# Altium schematic sheet Power_Amplifier.SchDoc
size A4; SheetNumber: 1; SheetTotal: 1; SPICEModelCachePYBBRKTT: <root> / <DocumentId>PYBBRKTT</DocumentId> / <CacheFrame Number="0"> / <Model Name="cap" Kind="MDL"> / <Text>*Default semiconductor capacitor / .MODEL CAP C()</Text> / </Model> / <Model Name="nmos" Kind="MDL"> / <Text>*Default N-Channel MOSFET / *Pinout: D,G,S / .MODEL NMOS NMOS()</Text> / </Model> / </CacheFrame> / </root>
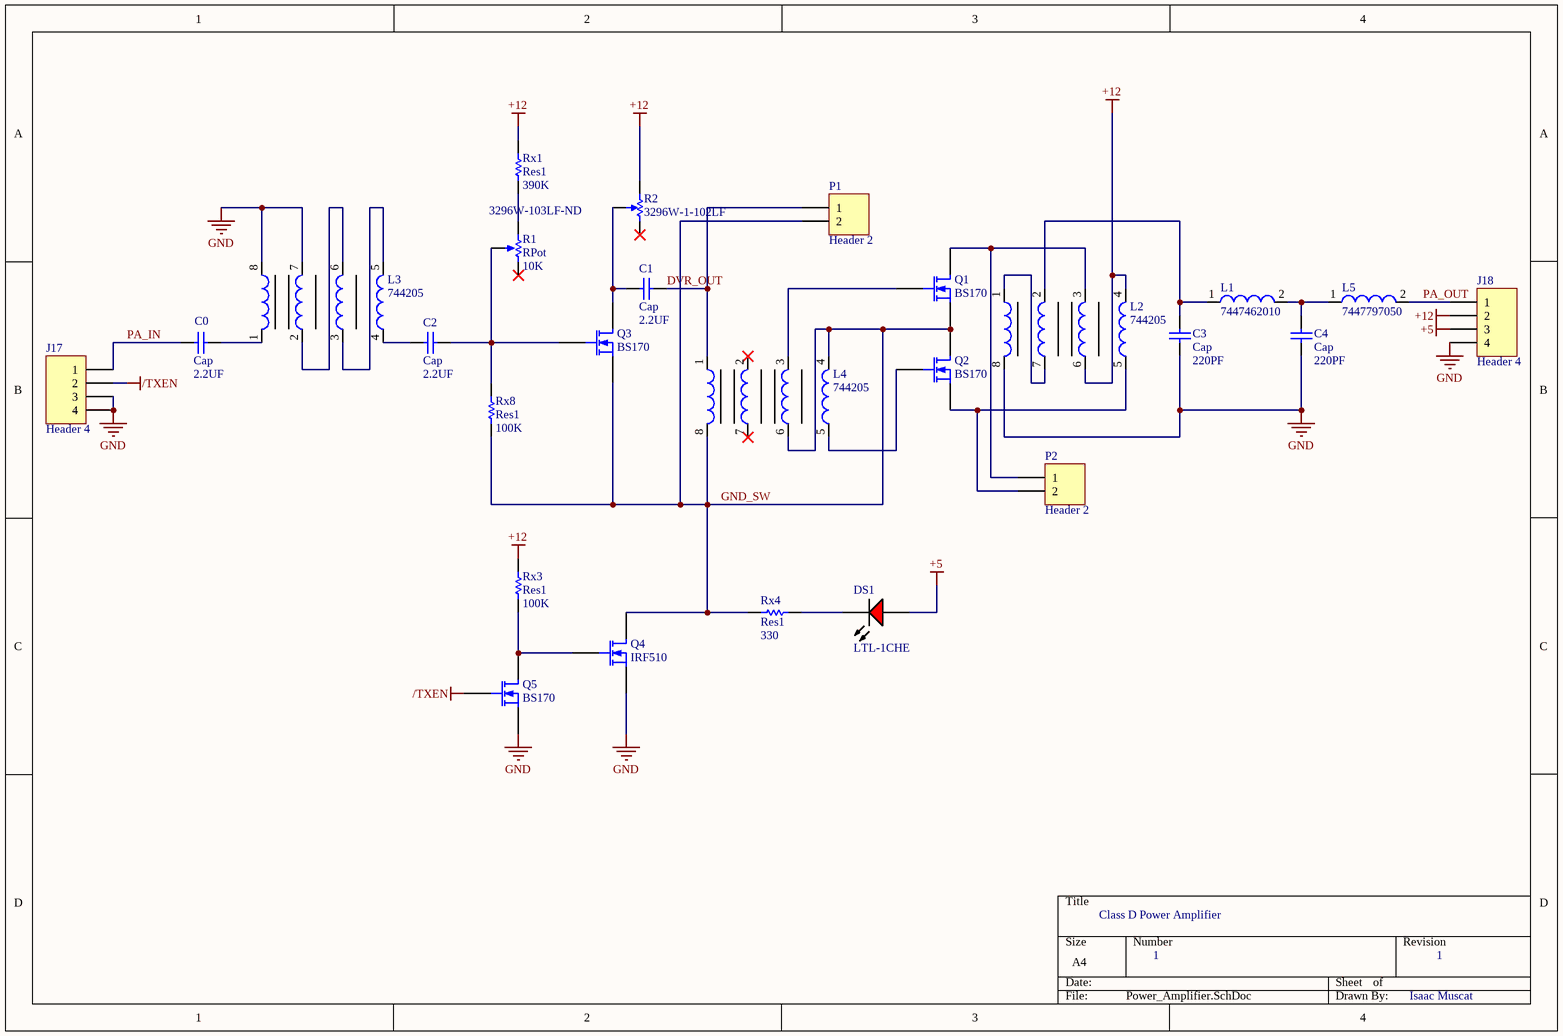
[diagram p0: Power_Amplifier.SchDoc]

## Parts
C0  Cap  value 2.2UF  [RADIAL-0.1]
C1  Cap  value 2.2UF  [RADIAL-0.1]
C2  Cap  value 2.2UF  [RADIAL-0.1]
C3  Cap  value 220PF  [RADIAL-0.1]
C4  Cap  value 220PF  [RADIAL-0.1]
DS1  LTL-1CHE  [INDPR60-254-520X380X650]
J17  Header 4  [HDR1X4]
J18  Header 4  [HDR1X4]
L1  7447462010  [WE-TI-XS]
L2  744205  [WE-SL]
L3  744205  [WE-SL]
L4  744205  [WE-SL]
L5  7447797050  [WE-PDF-1045]
P1  Header 2  [HDR1X2]
P2  Header 2  [HDR1X2]
Q1  BS170  [TO-92]
Q2  BS170  [TO-92]
Q3  BS170  [TO-92]
Q4  IRF510  [TO-220AB]
Q5  BS170  [TO-92]
R1  RPot  value 10K  Supplier Part Number 1: 3296W-103LF-ND  [VR5]
R2  3296W-1-102LF  [BOUR-3296W-1-3]
Rx1  Res1  value 390K  [AXIAL-0.1-RES]
Rx3  Res1  value 100K  [AXIAL-0.1-RES]
Rx4  Res1  value 330  [AXIAL-0.1-RES]
Rx8  Res1  value 100K  [AXIAL-0.1-RES]

## Nets
+5: DS1.1(A) J18.3
+12: J18.2 L2.4 L2.6 R2.1(A) Rx1.2 Rx3.1
/TXEN: J17.2 Q5.2(G)
GND: C3.1 C4.1 J17.3 J17.4 J18.4 L2.8 L3.7 L3.8 Q4.3(S) Q5.3(S)
DVR_OUT: C1.2 L4.1 P1.1
GND_SW: L4.4 L4.6 L4.8 P1.2 Q1.3(S) Q2.1(D) Q3.3(S) Q4.1(D) Rx4.1 Rx8.1
PA_IN: C0.1 J17.1
PA_OUT: J18.1 L5.2
NetC0_2: C0.2 L3.1
NetC1_1: C1.1 Q3.1(D) R2.3(TAP)
NetC2_1: C2.1 L3.4
NetC2_2: C2.2 Q3.2(G) R1.3(TAP) Rx8.2
NetC3_2: C3.2 L1.1 L2.2
NetC4_2: C4.2 L1.2 L5.1
NetDS1_2: DS1.2(K) Rx4.2
NetL2_1: L2.1 L2.7
NetL2_3: L2.3 P2.1 Q1.1(D)
NetL2_5: L2.5 P2.2 Q2.3(S)
NetL3_2: L3.2 L3.6
NetL3_3: L3.3 L3.5
NetL4_3: L4.3 Q1.2(G)
NetL4_5: L4.5 Q2.2(G)
NetQ4_2: Q4.2(G) Q5.1(D) Rx3.2
NetR1_1: R1.1(TOP) Rx1.1

Not connected (* = marked no-connect by the designer): L4 2* 7*; R1 2(BOT)*; R2 2(B)*

## Notes on the sheet
- Class D Power Amplifier
- 1
- Isaac Muscat

## Library data of the parts
C0-C2 = CAP CER 2.2UF 50V Z5U RADIAL: Capacitor; Manufacturer Part Number: C330C225M5U5TA7303; Designator: C?; Voltage Rating: 50V; Published: 8-Jun-2000; LatestRevisionDate: 17-Jul-2002; LatestRevisionNote: Re-released for DXP Platform.; Publisher: Altium Limited
C3 C4 = CAP CER 220PF 50V X7R RADIAL: Capacitor; Manufacturer Part Number: K221K15X7RF5TH5; Designator: C?; Voltage Rating: 50V; Published: 8-Jun-2000; LatestRevisionDate: 17-Jul-2002; LatestRevisionNote: Re-released for DXP Platform.; Publisher: Altium Limited
DS1 = CMP-1674-00005-1: Radial LED, 12.6 mcd, 20 mA, 2 V, -55 to 100 degC, 2-Pin THD, RoHS, Bulk; Shielding: Unshielded; Resistance: 0.045 Ohm; Current Rating: 3.6 A; Tolerance: 20%; PackageReference: LTL-1CHE; PackageDescription: 2-Pin Through Hole Device, Dia 3.8 mm, Pitch 2.54 mm; Case\Package: Radial; Length: 0.97 inch; Width: 0.62 inch; Height: 1.1 inch; Radiation Hardening: No; Lead Pitch: 11.44 mm; ComponentLink1URL: http://www.us.liteon.com/; ComponentLink1Description: Manufacturer URL; RoHSCompliant: true; Packaging: Tray; Mount: Through Hole; Min Operating Temperature: -40 degC; Max Operating Temperature: 130 degC; ComponentLink2URL: https://datasheet.ciiva.com/15117/getdatasheetpartid-187746-15117985.pdf; Package Quantity: 55; ComponentLink2Description: Datasheet; DatasheetVersion: Dec-03
J17 J18 = Header 4: Header, 4-Pin; LatestRevisionDate: 17-Jul-2002; LatestRevisionNote: Re-released for DXP Platform.; Publisher: Altium Limited
L1 = CMP-0225-00026-1: Radial Leaded Wire Wound Inductor WE-TI, L = 1.00 µH; Inductance: 1.00 ÂµH; PackageDescription: THT Inductor, 2-Leads, Body 6.0 x 6.0 mm; DatasheetVersion: ver 2, Jan-2011; PackageReference: WE-TI-XS; ComponentLink2URL: http://www.we-online.de/katalog/media/pdf/7447462010.pdf; ComponentLink1URL: http://www.we-online.com; ComponentLink2Description: Datasheet; PackageVersion: 2011; ComponentLink1Description: Manufacturer Link
L2-L4 = CMP-0222-00030-1: SMD Common Mode Line Filter WE-SL, L = 100 µH; Inductance: 100 ÂµH; PackageDescription: SMD Inductor, 8-Leads, Body 10.5 x 9.7 mm; ComponentLink2URL: http://www.we-online.de/katalog/media/pdf/744205.pdf; ComponentLink2Description: Datasheet; ComponentLink1URL: http://www.we-online.com; PackageReference: WE-SL; ComponentLink1Description: Manufacturer Link; DatasheetVersion: ver 6, Dec-2010; PackageVersion: 2010
L5 = CMP-0227-00047-1: SMD Power Inductor WE-PDF, L = 0.50 µH; Inductance: 0.50 ÂµH; ComponentLink2URL: http://www.we-online.de/katalog/media/pdf/7447797050.pdf; PackageDescription: SMD Inductor, 2-Leads, Body 10.2 x 10.2 mm; ComponentLink2Description: Datasheet; PackageVersion: 2009; DatasheetVersion: ver 2, Jul-2009; ComponentLink1Description: Manufacturer Link; ComponentLink1URL: http://www.we-online.com; PackageReference: WE-PDF-1045
P1 P2 = Header 2: Header, 2-Pin; LatestRevisionDate: 17-Jul-2002; LatestRevisionNote: Re-released for DXP Platform.; Publisher: Altium Limited
Q1-Q5 = MOSFET-N: N-Channel MOSFET; Published: 8-Jun-2000; LatestRevisionDate: 17-Jul-2002; LatestRevisionNote: Re-released for DXP Platform.; PackageVersion: 1995/1996; PackageReference: E3; Publisher: Altium Limited; PackageDescription: TO, Flat Index; 3 In-Line, Axial Leads; Body Dia. 4.6mm; Lead Dia. 0.5 mm (max)
R1 = RPot: Potentiometer; Sim Note: Enter the Resistance value and the set point into parameter fields.; Set Position: 0.5; Published: 8-Jun-2000; LatestRevisionDate: 17-Jul-2002; LatestRevisionNote: Re-released for DXP Platform.; PackageReference: VR5; Publisher: Altium Limited; PackageDescription: Variable Resistor, Thru-Hole; 3 Leads; Supplier 1: Digi-Key
R2 = CMP-1747-00002-1: Square Trimpot(R) Trimming Potentiometer, 1000 Ohm, -55 to 125 degC, 3-Pin THD, RoHS, Tube; Case\Package: 0603; Tolerance: 1%; Power Rating: 100 mW; Voltage Rating: 75 V; Resistance: 4.7 kohm; ComponentLink2URL: http://www.bourns.com/docs/Product-Datasheets/3296.pdf; Packaging: Tape and Reel; REACH SVHC: Yes; ComponentLink1URL: http://www.bourns.com/; Case Code (Metric): 1608; Width: 0.8 mm; ComponentLink1Description: Manufacturer URL; DatasheetVersion: May-16; Max Operating Temperature: 155 degC; PackageReference: 3296W-1-3; PackageDescription: 3-Pin Through Hole Device, Body 9.53 x 4.83 mm, Pitch 2.54 mm; Weight: 7.1E-05 oz; ComponentLink2Description: Datasheet; RoHSCompliant: true; Min Operating Temperature: -55 degC; Radiation Hardening: No; Case Code (Imperial): 0603; Length: 1.6 mm; Package Quantity: 5000; Pins: 2; Mount: Surface Mount; Height: 0.45 mm
Rx1 = RES 390K OHM 5% 1/4W AXIAL: Resistor; Manufacturer Part Number: CFR-25JB-52-390K; Designator: R?; Power Rating: 1/4W; Tolerance: 0.05; Published: 8-Jun-2000; LatestRevisionDate: 17-Jul-2002; LatestRevisionNote: Re-released for DXP Platform.; Publisher: Altium Limited
Rx3 Rx8 = RES 10K OHM 5% 1/4W AXIAL: Resistor; Manufacturer Part Number: CFR-25JB-52-10K; Designator: R?; Power Rating: 1/4W; Tolerance: 0.05; Published: 8-Jun-2000; LatestRevisionDate: 17-Jul-2002; LatestRevisionNote: Re-released for DXP Platform.; Publisher: Altium Limited
Rx4 = RES 330 OHM 5% 1/4W AXIAL: Resistor; Manufacturer Part Number: CFR-25JB-52-330R; Designator: R?; Power Rating: 1/4W; Tolerance: 0.05; Published: 8-Jun-2000; LatestRevisionDate: 17-Jul-2002; LatestRevisionNote: Re-released for DXP Platform.; Publisher: Altium Limited